# EasyEDA Pro project MotionController.eprj

# Schematic Schematic1
Board Name: Board1; Create Date: 2025-10-31; Page Name: P1; Project Name: MotionController; Schematic Name: Schematic1; Update Date: 2025-11-20; Company: 嘉立创EDA; Page Size: A4; Version: V1.0
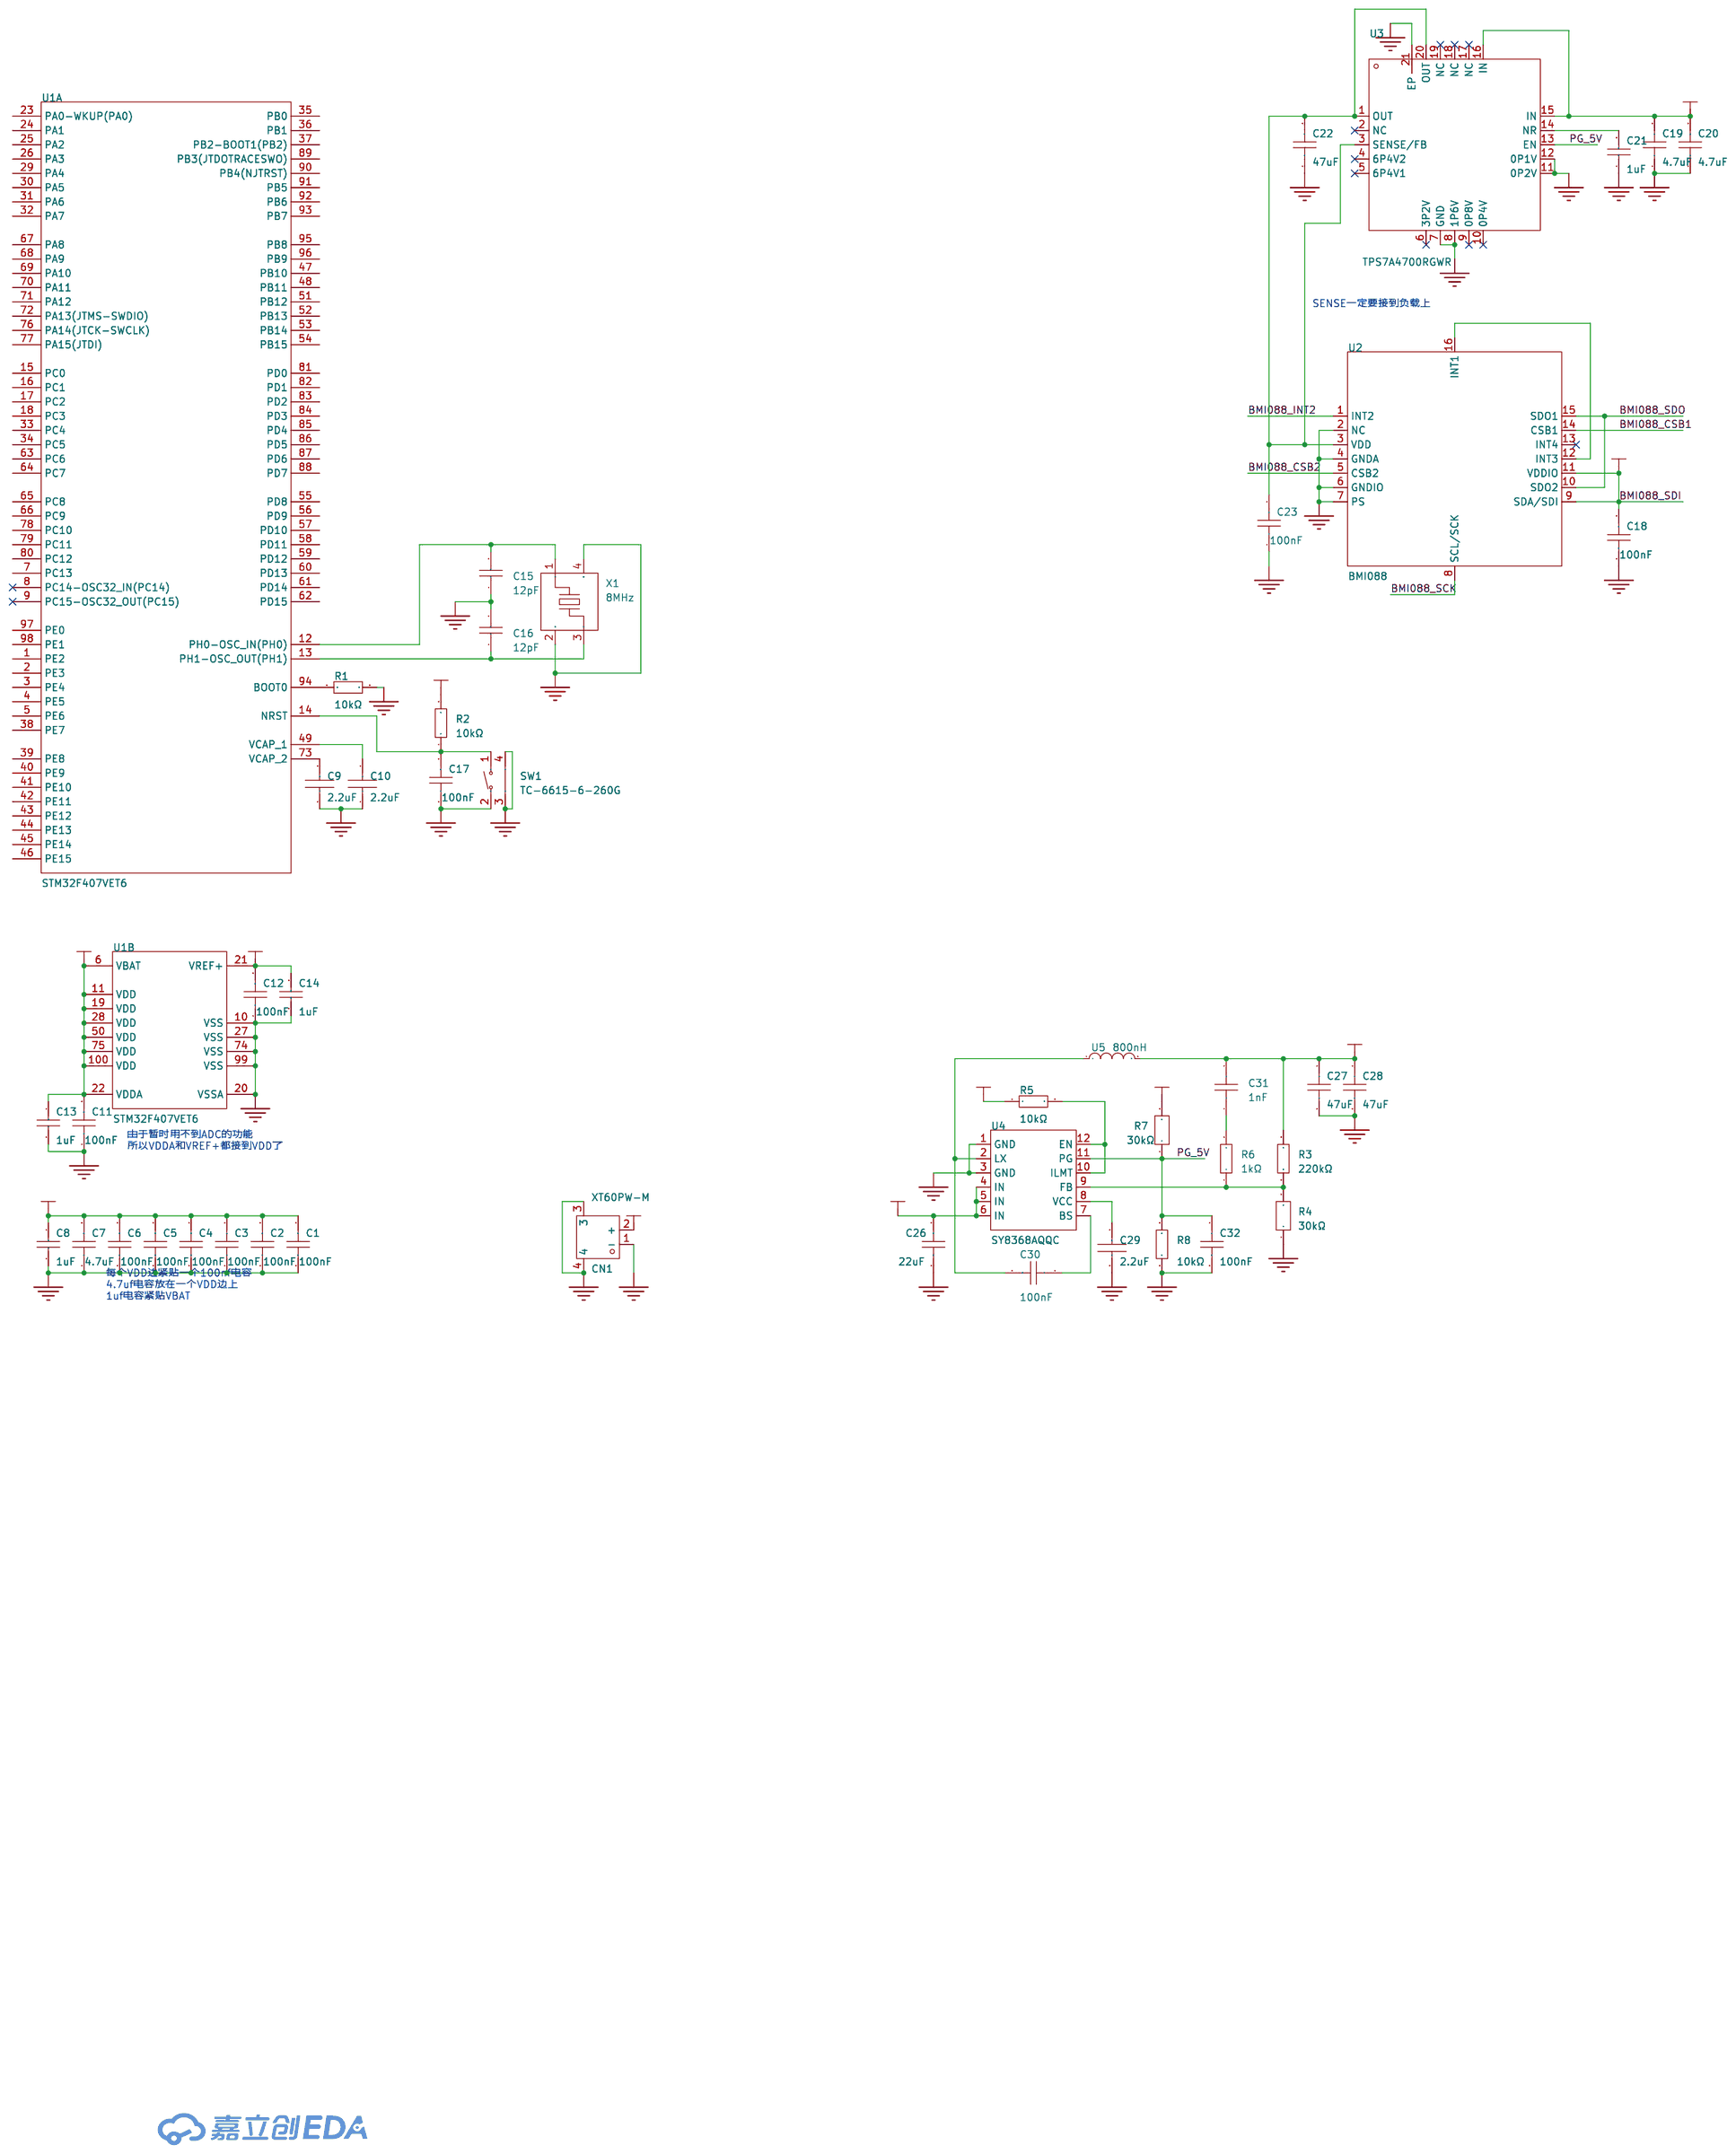
[diagram p0: schematic sheet]

## Parts
C1  100nF  [C0402]
C2  100nF  [C0402]
C3  100nF  [C0402]
C4  100nF  [C0402]
C5  100nF  [C0402]
C6  100nF  [C0402]
C7  4.7uF  [C0603]
C8  1uF  [C0402]
C9  2.2uF  [C0402]
C10  2.2uF  [C0402]
C11  100nF  [C0402]
C12  100nF  [C0402]
C13  1uF  [C0402]
C14  1uF  [C0402]
C15  12pF  [C0402]
C16  12pF  [C0402]
C17  100nF  [C0402]
C18  100nF  [C0402]
C19  4.7uF  [C0603]
C20  4.7uF  [C0603]
C21  1uF  [C0402]
C22  47uF  [C0805]
C23  100nF  [C0402]
C26  22uF  [C0805]
C27  47uF  [C0805]
C28  47uF  [C0805]
C29  2.2uF  [C0402]
C30  100nF  [C0402]
C31  1nF  [C0402]
C32  100nF  [C0402]
CN1  XT60PW-M  [CONN-TH_XT60PW-M]
R1  10kΩ  [R0402]
R2  10kΩ  [R0402]
R3  220kΩ  [R0402]
R4  30kΩ  [R0402]
R5  10kΩ  [R0402]
R6  1kΩ  [R0402]
R7  30kΩ  [R0402]
R8  10kΩ  [R0402]
SW1  TC-6615-6-260G  [KEY-TH_TC-6615-6-160G]
U1  STM32F407VET6  [LQFP-100_L14.0-W14.0-P0.50-LS16.0-BL]  (sections 1,2)
U2  BMI088  [LGA-16_L4.5-W3.0-P0.50-BL]
U3  TPS7A4700RGWR  [VQFN-20_L5.0-W5.0-P0.65-TL-EP]
U4  SY8368AQQC  [QFN-12_L3.0-W3.0-P0.45-TL-EP]
U5  800nH  [IND-SMD_L11.5-W10.0_PSPMAA1040H-330M-ANP]
X1  8MHz  [CRYSTAL-SMD_4P-L3.2-W2.5-BL]

## Library data of the parts
C1-C6 C11 C12 C17 C18 C23 C30 C32 = FCC0402B104K160AT: LCSC Part Name: 100nF ±10% 16V; Supplier Part: C5137468; Manufacturer: FOJAN(富捷); Supplier Footprint: 0402; JLCPCB Part Class: 扩展库; Datasheet: https://item.szlcsc.com/datasheet/FCC0402B104K160AT/5746970.html; Supplier: LCSC; Tolerance: ±10%; Voltage Rating: 16V; Temperature Coefficient: X7R
C7 C19 C20 = CL10A475KO8NNNC: LCSC Part Name: 4.7uF ±10% 16V; Supplier Part: C19666; Manufacturer: SAMSUNG(三星); Supplier Footprint: 0603; JLCPCB Part Class: 基础库; Datasheet: https://item.szlcsc.com/datasheet/CL10A475KO8NNNC/20375.html; Supplier: LCSC; Tolerance: ±10%; Voltage Rating: 16V; Temperature Coefficient: X5R
C8 C13 C14 C21 = CL05A105KP5NNNC: LCSC Part Name: 1uF ±10% 10V; Supplier Part: C14445; Manufacturer: SAMSUNG(三星); Supplier Footprint: 0402; JLCPCB Part Class: 扩展库; Datasheet: https://item.szlcsc.com/datasheet/CL05A105KP5NNNC/15107.html; Supplier: LCSC; Tolerance: ±10%; Voltage Rating: 10V; Temperature Coefficient: X5R
C9 C10 C29 = CL05A225MQ5NSNC: LCSC Part Name: 2.2uF ±20% 6.3V; Supplier Part: C12530; Manufacturer: SAMSUNG(三星); Supplier Footprint: 0402; JLCPCB Part Class: 基础库; Datasheet: https://item.szlcsc.com/datasheet/CL05A225MQ5NSNC/13164.html; Supplier: LCSC; Tolerance: ±20%; Voltage Rating: 6.3V; Temperature Coefficient: X5R
C15 C16 = 0402CG120J500NT: LCSC Part Name: 12pF ±5% 50V; Supplier Part: C1547; Manufacturer: FH(风华); Supplier Footprint: 0402; JLCPCB Part Class: 基础库; Datasheet: https://item.szlcsc.com/datasheet/0402CG120J500NT/1899.html; Supplier: LCSC; Tolerance: ±5%; Voltage Rating: 50V; Temperature Coefficient: C0G
C22 C27 C28 = CGA0805X5R476M100MT: LCSC Part Name: 47uF ±20% 10V; Supplier Part: C6119904; Manufacturer: HRE(芯声); Supplier Footprint: 0805; JLCPCB Part Class: 扩展库; Supplier: LCSC; Tolerance: ±20%; Voltage Rating: 10V; Temperature Coefficient: X5R
C26 = CL21A226MAQNNNE: LCSC Part Name: 22uF ±20% 25V; Supplier Part: C45783; Manufacturer: SAMSUNG(三星); Supplier Footprint: 0805; JLCPCB Part Class: 基础库; Datasheet: https://item.szlcsc.com/datasheet/CL21A226MAQNNNE/46786.html; Supplier: LCSC; Tolerance: ±20%; Voltage Rating: 25V; Temperature Coefficient: X5R
C31 = FCC0402B102K500AT: LCSC Part Name: 1nF ±10% 50V; Supplier Part: C5137470; Manufacturer: FOJAN(富捷); Supplier Footprint: 0402; JLCPCB Part Class: 扩展库; Datasheet: https://item.szlcsc.com/datasheet/FCC0402B102K500AT/5746972.html; Supplier: LCSC; Tolerance: ±10%; Voltage Rating: 50V; Temperature Coefficient: X7R
CN1 = XT60PW-M: LCSC Part Name: AMASS(艾迈斯)航模插头xt60连接器150公母对接pw锂电池公头 板插卧式XT60PW-M; Supplier Part: C98732; Manufacturer: AMASS(艾迈斯); JLCPCB Part Class: 扩展库; Datasheet: https://item.szlcsc.com/datasheet/XT60PW-M/99942.html; Supplier: LCSC; Type: 卧式插头; Colour: 黄色; InterfaceType: 公头
R1 R2 R5 R8 = 0402WGF1002TCE: LCSC Part Name: 10kΩ ±1% 62.5mW 厚膜电阻; Supplier Part: C25744; Manufacturer: UNI-ROYAL(厚声); Supplier Footprint: 0402; JLCPCB Part Class: 基础库; Datasheet: https://item.szlcsc.com/datasheet/0402WGF1002TCE/26487.html; Supplier: LCSC; Type: 厚膜电阻; Tolerance: ±1%; Power(Watts): 62.5mW; Voltage-Supply(Max): 50V; Temperature Coefficient: ±100ppm/℃; Operating Temperature: -55℃~+155℃
R3 = 0402WGF2203TCE: LCSC Part Name: 220kΩ ±1% 62.5mW 厚膜电阻; Supplier Part: C25767; Manufacturer: UNI-ROYAL(厚声); Supplier Footprint: 0402; JLCPCB Part Class: 扩展库; Datasheet: https://item.szlcsc.com/datasheet/0402WGF2203TCE/26510.html; Supplier: LCSC; Type: 厚膜电阻; Tolerance: ±1%; Power(Watts): 62.5mW; Voltage-Supply(Max): 50V; Temperature Coefficient: ±100ppm/℃; Operating Temperature: -55℃~+155℃
R4 R7 = FRC0402F3002TS: LCSC Part Name: 30kΩ ±1% 62.5mW 厚膜电阻; Supplier Part: C2909347; Manufacturer: FOJAN(富捷); Supplier Footprint: 0402; JLCPCB Part Class: 扩展库; Supplier: LCSC; Type: 厚膜电阻; Tolerance: ±1%; Power(Watts): 62.5mW; Voltage-Supply(Max): 50V; Temperature Coefficient: ±100ppm/℃; Operating Temperature: -55℃~+155℃
R6 = 0402WGF1001TCE: LCSC Part Name: 1kΩ ±1% 62.5mW 厚膜电阻; Supplier Part: C11702; Manufacturer: UNI-ROYAL(厚声); Supplier Footprint: 0402; JLCPCB Part Class: 基础库; Datasheet: https://item.szlcsc.com/datasheet/0402WGF1001TCE/12256.html; Supplier: LCSC; Type: 厚膜电阻; Tolerance: ±1%; Power(Watts): 62.5mW; Voltage-Supply(Max): 50V; Temperature Coefficient: ±100ppm/℃; Operating Temperature: -55℃~+155℃
SW1 = TC-6615-6-260G: LCSC Part Name: 轻触6*6*6支架 插件260g; Supplier Part: C2845272; Manufacturer: HCTL(华灿天禄); Supplier Footprint: 插件; JLCPCB Part Class: 扩展库; Datasheet: https://atta.szlcsc.com/upload/public/pdf/source/20230523/3B07ECEFF69432C539FEAF1B55455C52.pdf; Supplier: LCSC; Circuit: 单刀单掷; Actuator Style: 圆形按钮; Operating Force: 260gf; Mounting Style: 立贴; Switch Length: 6mm; Switch Width: 6mm; Switch Height: 6mm; Strike Gundam: 带支架; Contact Current: 50mA; Voltage Rating (DC): 12V; Actuator/Cap Color: 黑色; Pin Style: 鸥翼型; Mechanical Life: 10万次
U1 = STM32F407VET6: LCSC Part Name: 带DSP和FPU的高性能基础系列ARM Cortex-M4 MCU，具有512 KB Flash、168 MHz CPU、ART加速器、以太网和FSMC; Supplier Part: C28730; Manufacturer: ST(意法半导体); Supplier Footprint: LQFP-100(14x14); JLCPCB Part Class: 扩展库; Datasheet: https://item.szlcsc.com/datasheet/STM32F407VET6/29482.html; Supplier: LCSC; CPU Core: ARM-M4; CPU Maximum Speed: 168MHz; Program Storage Size: 512KB; Program Memory Type: FLASH; Number of I/O: 82; ADC (Bit): 12bit; DAC (Bit): 12bit; Voltage - Supply: 1.8V~3.6V
U2 = BMI088: Supplier Part: C194919; Manufacturer: Bosch(博世); Supplier Footprint: LGA-16(3x4.5); JLCPCB Part Class: 扩展库; Datasheet: https://atta.szlcsc.com/upload/public/pdf/source/20180628/C194919_66CCF125FF968C218A4D358C68AC68D6.pdf; Supplier: LCSC; Sensor Type: 加速度计陀螺仪; Operating Temperature: -40℃~+85℃
U3 = TPS7A4700RGWR: LCSC Part Name: 具有使能功能的 1A、36V、低噪声、高 PSRR、低压降稳压器; Supplier Part: C114839; Manufacturer: TI(德州仪器); Supplier Footprint: VQFN-20-EP(5x5); JLCPCB Part Class: 扩展库; Datasheet: https://www.ti.com/cn/lit/gpn/tps7a47; Supplier: LCSC; Output Type: 可调; Voltage - Supply: 35V; Output Voltage: 1.4V~20.5V; Output Current: 1A; Power Supply Rejection Ratio (PSRR): 78dB; Voltage Dropout: 307mV@(1A); standby current: 580uA; Noise: 4uVrms; Features: 过热保护；过流保护；带使能；欠压锁定; Operating Temperature: -40℃~+125℃@(Tj); Output Configuration: 正极; Number of Outputs: 1
U4 = SY8368AQQC: LCSC Part Name: 高效快速响应8A连续16A峰值28V输入同步降压调节器; Supplier Part: C207642; Manufacturer: Silergy(矽力杰); Supplier Footprint: QFN-12(3x3); JLCPCB Part Class: 扩展库; Datasheet: https://item.szlcsc.com/datasheet/SY8368AQQC/208858.html; Supplier: LCSC; Function: 降压型; Voltage - Supply: 4V~28V; Output Voltage: 5V; Output Current: 8A; Frequency - Switching: 800kHz; Operating Temperature: -40℃~+125℃@(TJ); Synchronous Rectifier: 是; Number of Outputs: 1; Topology: 降压式; Quiescent Current: 100uA; Switch tube (built-in/external): 内置
U5 = XR1040-R80M: LCSC Part Name: 800nH ±20% 29A; Supplier Part: C5339442; Manufacturer: XR(祥如); Supplier Footprint: SMD,11.5x10mm; JLCPCB Part Class: 扩展库; Datasheet: https://atta.szlcsc.com/upload/public/pdf/source/20240328/B6F7A8D09E6F16895FF613065C3AE614.pdf; Supplier: LCSC; Tolerance: ±20%; Current Rating: 23A; Current - Saturation(Isat): 29A; DC Resistance(DCR): 2.7mΩ; Type: 一体成型电感
X1 = XTM32008000GT00351001: LCSC Part Name: 8MHz 4P 3225 10pF ±10ppm -20~70℃（±10ppm）; Supplier Part: C42464264; Manufacturer: 同晶; Supplier Footprint: SMD3225-4P; Datasheet: https://item.szlcsc.com/datasheet/XTM32008000GT00351001/44559671.html; Supplier: LCSC; Type: 贴片晶振; Normal temperature Frequency Tolerance: ±10ppm; Load Capacitance: 10pF; Frequency Stability: ±10ppm; Equivalent Series Resistance(ESR): 180Ω; Operating Temperature: -20℃~+70℃

## Nets
3.3V: C1.2 C2.2 C3.2 C4.2 C5.2 C6.2 C7.2 C8.2 C11.2 C12.2 C13.2 C14.2 C18.2 R2.2 U1.6(VBAT) U1.11(VDD) U1.19(VDD) U1.21(VREF+) U1.22(VDDA) U1.28(VDD) U1.50(VDD) U1.75(VDD) U1.100(VDD) U2.11(VDDIO)
5V: C19.2 C20.2 C27.1 C28.1 C31.2 R3.2 U3.15(IN) U3.16(IN) U5.2
GND: C1.1 C2.1 C3.1 C4.1 C5.1 C6.1 C7.1 C8.1 C9.1 C10.1 C11.1 C12.1 C13.1 C14.1 C15.1 C16.2 C17.1 C18.1 C19.1 C20.1 C21.1 C22.1 C23.1 C26.1 C27.2 C28.2 C29.1 C32.2 CN1.1(-) CN1.3 CN1.4 R1.2 R4.1 R8.1 SW1.2 SW1.3 SW1.4 U1.10(VSS) U1.20(VSSA) U1.27(VSS) U1.74(VSS) U1.99(VSS) U2.2(NC) U2.4(GNDA) U2.6(GNDIO) U2.7(PS) U3.7(GND) U3.8(1P6V) U3.11(0P2V) U3.12(0P1V) U3.21(EP) U4.1(GND) U4.3(GND) X1.2(GND) X1.4(GND)
BAT: C26.2 CN1.2(+) R5.1 R7.2 U4.4(IN) U4.5(IN) U4.6(IN)
BMI088_CSB1: U2.14(CSB1)
BMI088_CSB2: U2.5(CSB2)
BMI088_INT2: U2.1(INT2)
BMI088_SCK: U2.8(SCL/SCK)
BMI088_SDI: U2.9(SDA/SDI)
BMI088_SDO: U2.10(SDO2) U2.15(SDO1)
PG_5V: C32.1 R7.1 R8.2 U3.13(EN) U4.11(PG)
Net-(C9-2): C9.2 U1.73(VCAP_2)
Net-(C10-2): C10.2 U1.49(VCAP_1)
Net-(C15-2): C15.2 U1.12(PH0-OSC_IN(PH0)) X1.1
Net-(C16-1): C16.1 U1.13(PH1-OSC_OUT(PH1)) X1.3
Net-(C17-2): C17.2 R2.1 SW1.1 U1.14(NRST)
Net-(C21-2): C21.2 U3.14(NR)
Net-(C22-2): C22.2 C23.2 U2.3(VDD) U3.1(OUT) U3.3(SENSE/FB) U3.20(OUT)
Net-(C29-2): C29.2 U4.8(VCC)
Net-(C30-1): C30.1 U4.7(BS)
Net-(C30-2): C30.2 U4.2(LX) U5.1
Net-(C31-1): C31.1 R6.2
Net-(R1-1): R1.1 U1.94(BOOT0)
Net-(R3-1): R3.1 R4.2 R6.1 U4.9(FB)
Net-(R5-2): R5.2 U4.10(ILMT) U4.12(EN)
Net-(U2-12): U2.12(INT3) U2.16(INT1)

Not connected (* = marked no-connect by the designer): U1 1(PE2) 2(PE3) 3(PE4) 4(PE5) 5(PE6) 7(PC13) 8(PC14-OSC32_IN(PC14))* 9(PC15-OSC32_OUT(PC15))* 15(PC0) 16(PC1) 17(PC2) 18(PC3) 23(PA0-WKUP(PA0)) 24(PA1) 25(PA2) 26(PA3) 29(PA4) 30(PA5) 31(PA6) 32(PA7) 33(PC4) 34(PC5) 35(PB0) 36(PB1) 37(PB2-BOOT1(PB2)) 38(PE7) 39(PE8) 40(PE9) 41(PE10) 42(PE11) 43(PE12) 44(PE13) 45(PE14) 46(PE15) 47(PB10) 48(PB11) 51(PB12) 52(PB13) 53(PB14) 54(PB15) 55(PD8) 56(PD9) 57(PD10) 58(PD11) 59(PD12) 60(PD13) 61(PD14) 62(PD15) 63(PC6) 64(PC7) 65(PC8) 66(PC9) 67(PA8) 68(PA9) 69(PA10) 70(PA11) 71(PA12) 72(PA13(JTMS-SWDIO)) 76(PA14(JTCK-SWCLK)) 77(PA15(JTDI)) 78(PC10) 79(PC11) 80(PC12) 81(PD0) 82(PD1) 83(PD2) 84(PD3) 85(PD4) 86(PD5) 87(PD6) 88(PD7) 89(PB3(JTDOTRACESWO)) 90(PB4(NJTRST)) 91(PB5) 92(PB6) 93(PB7) 95(PB8) 96(PB9) 97(PE0) 98(PE1); U2 13(INT4)*; U3 2(NC)* 4(6P4V2)* 5(6P4V1)* 6(3P2V)* 9(0P8V)* 10(0P4V)* 17(NC)* 18(NC)* 19(NC)*

## Notes on the sheet
- SENSE一定要接到负载上
- 由于暂时用不到ADC的功能
  所以VDDA和VREF+都接到VDD了
- 每个VDD边紧贴一个100nf电容
  4.7uf电容放在一个VDD边上
  1uf电容紧贴VBAT
